# EAGLE design universal-i2c-sensor-master-unit (EAGLE 9.3.1)

## Sheet 1 of 3
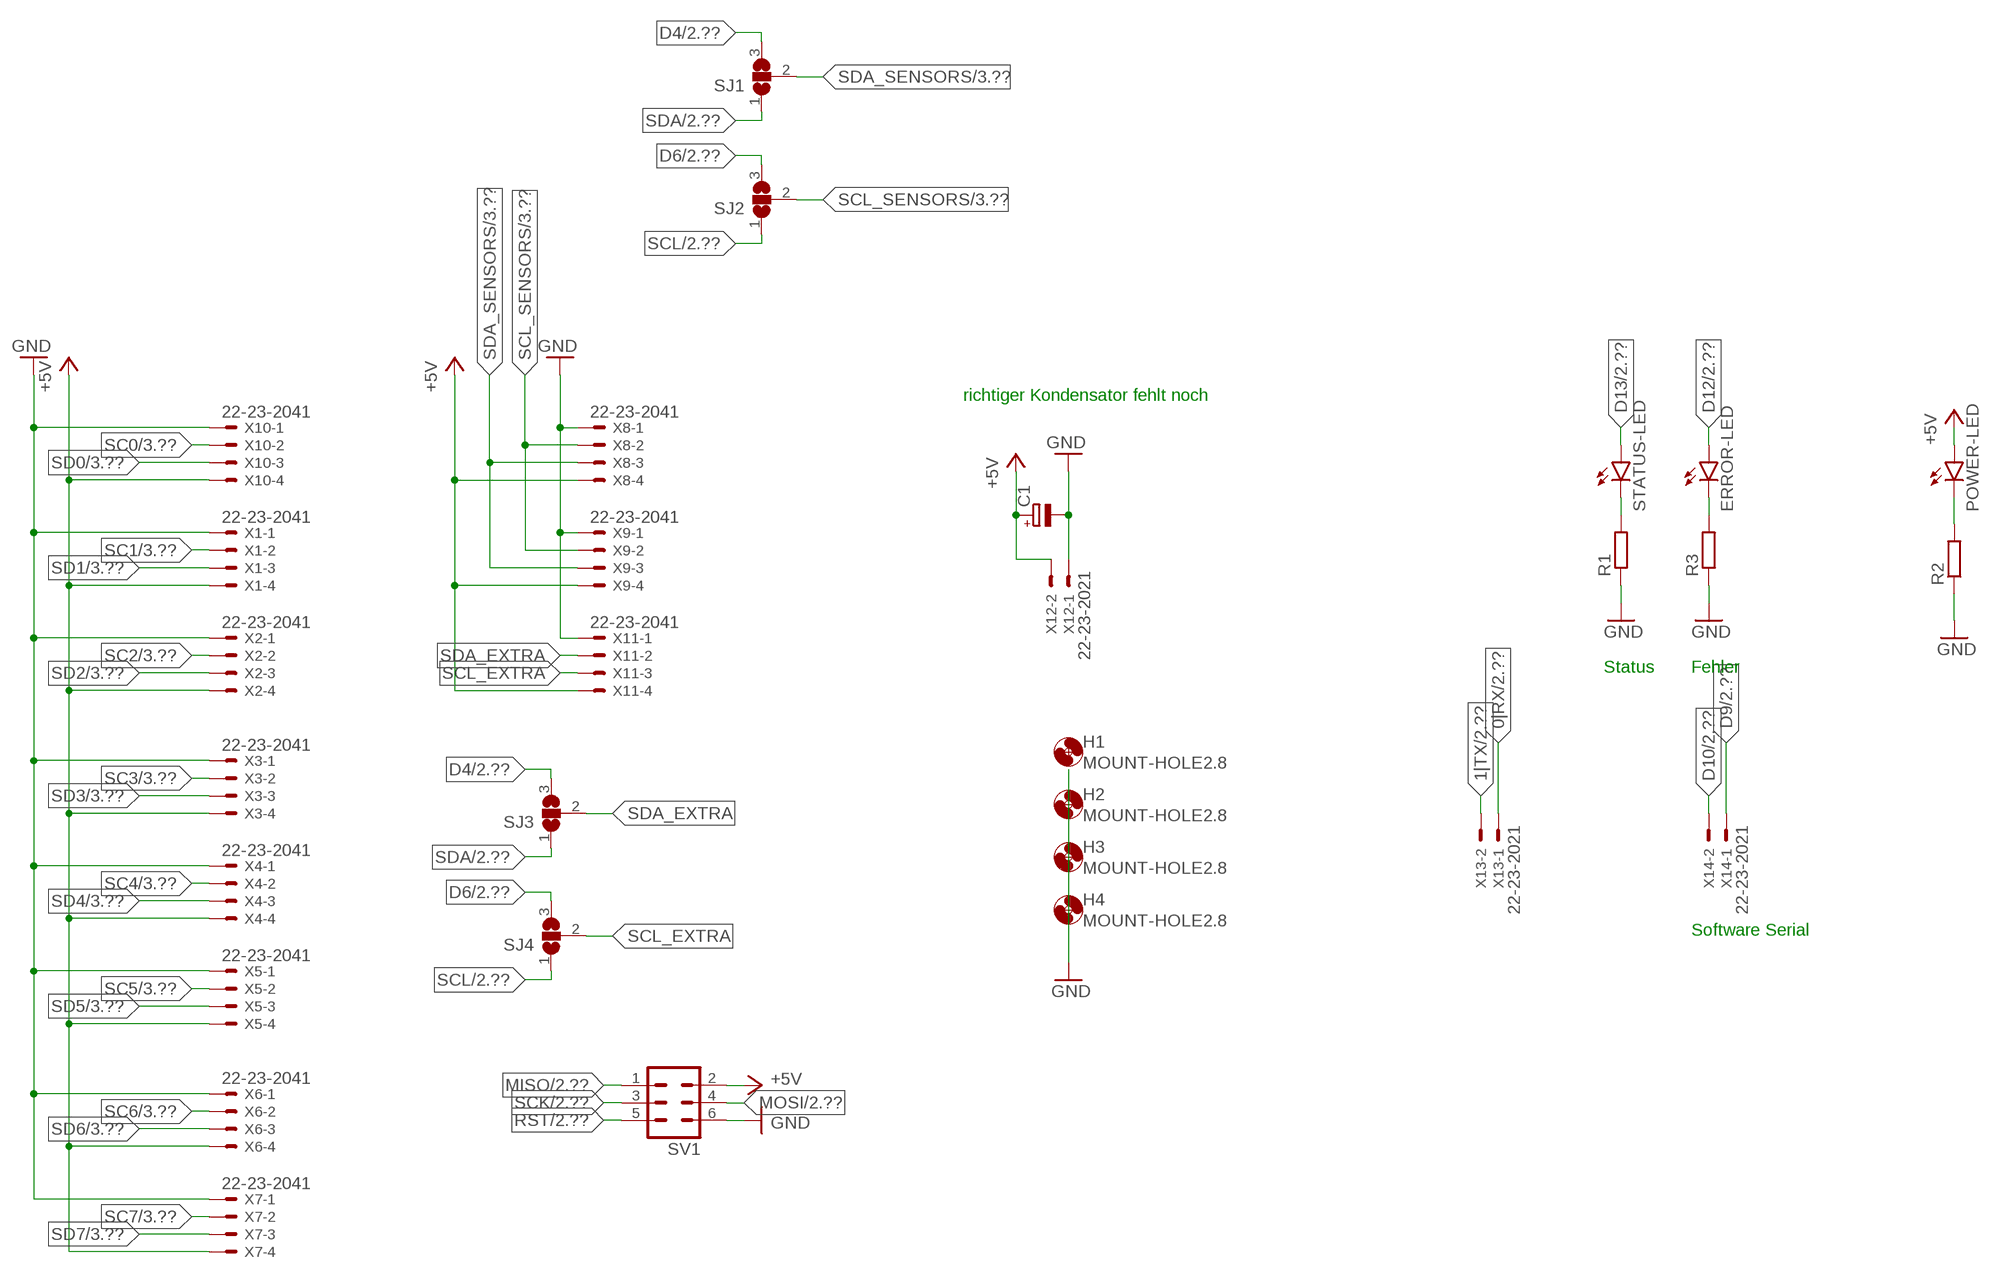
[diagram p0: schematic, sheet 1]

### Parts
C1  CPOL-EUE2.5-6  [E2,5-6]
ERROR-LED  LED3MM  [LED3MM]
H1  MOUNT-HOLE2.8  [2,8]
H2  MOUNT-HOLE2.8  [2,8]
H3  MOUNT-HOLE2.8  [2,8]
H4  MOUNT-HOLE2.8  [2,8]
POWER-LED  LED3MM  [LED3MM]
R1  R-EU_0207/10  [0207/10]
R2  R-EU_0207/10  [0207/10]
R3  R-EU_0207/10  [0207/10]
SJ1  SJ2W  [SJ_2]
SJ2  SJ2W  [SJ_2]
SJ3  SJ2W  [SJ_2]
SJ4  SJ2W  [SJ_2]
STATUS-LED  LED3MM  [LED3MM]
SV1  MA03-2  [MA03-2]
X1  22-23-2041  [22-23-2041]
X2  22-23-2041  [22-23-2041]
X3  22-23-2041  [22-23-2041]
X4  22-23-2041  [22-23-2041]
X5  22-23-2041  [22-23-2041]
X6  22-23-2041  [22-23-2041]
X7  22-23-2041  [22-23-2041]
X8  22-23-2041  [22-23-2041]
X9  22-23-2041  [22-23-2041]
X10  22-23-2041  [22-23-2041]
X11  22-23-2041  [22-23-2041]
X12  22-23-2021  [22-23-2021]
X13  22-23-2021  [22-23-2021]
X14  22-23-2021  [22-23-2021]

### Nets
0|RX: X13.1 ; also sheet 2
1|TX: X13.2 ; also sheet 2
+5V: C1.+ POWER-LED.A SV1.2 X1.4 X2.4 X3.4 X4.4 X5.4 X6.4 X7.4 X8.4 X9.4 X10.4 X11.4 X12.2 ; also sheet 2,3
D4: SJ1.3 SJ3.3 ; also sheet 2
D6: SJ2.3 SJ4.3 ; also sheet 2
D9: X14.1 ; also sheet 2
D10: X14.2 ; also sheet 2
D12: ERROR-LED.A ; also sheet 2
D13: STATUS-LED.A ; also sheet 2
GND: C1.- R1.1 R2.1 R3.1 SV1.6 X1.1 X2.1 X3.1 X4.1 X5.1 X6.1 X7.1 X8.1 X9.1 X10.1 X11.1 X12.1 ; also sheet 2,3
MISO: SV1.1 ; also sheet 2
MOSI: SV1.4 ; also sheet 2
N$1: R1.2 STATUS-LED.K(C)
N$2: POWER-LED.K(C) R2.2
N$3: ERROR-LED.K(C) R3.2
RST: SV1.5 ; also sheet 2
SC0: X10.2 ; also sheet 3
SC1: X1.2 ; also sheet 3
SC2: X2.2 ; also sheet 3
SC3: X3.2 ; also sheet 3
SC4: X4.2 ; also sheet 3
SC5: X5.2 ; also sheet 3
SC6: X6.2 ; also sheet 3
SC7: X7.2 ; also sheet 3
SCK: SV1.3 ; also sheet 2
SCL: SJ2.1 SJ4.1 ; also sheet 2
SCL_EXTRA: SJ4.2 X11.3
SCL_SENSORS: SJ2.2 X8.2 X9.2 ; also sheet 3
SD0: X10.3 ; also sheet 3
SD1: X1.3 ; also sheet 3
SD2: X2.3 ; also sheet 3
SD3: X3.3 ; also sheet 3
SD4: X4.3 ; also sheet 3
SD5: X5.3 ; also sheet 3
SD6: X6.3 ; also sheet 3
SD7: X7.3 ; also sheet 3
SDA: SJ1.1 SJ3.1 ; also sheet 2
SDA_EXTRA: SJ3.2 X11.2
SDA_SENSORS: SJ1.2 X8.3 X9.3 ; also sheet 3

### Notes on the sheet
- richtiger Kondensator fehlt noch
- Status | Fehler
- Software Serial

## Sheet 2 of 3
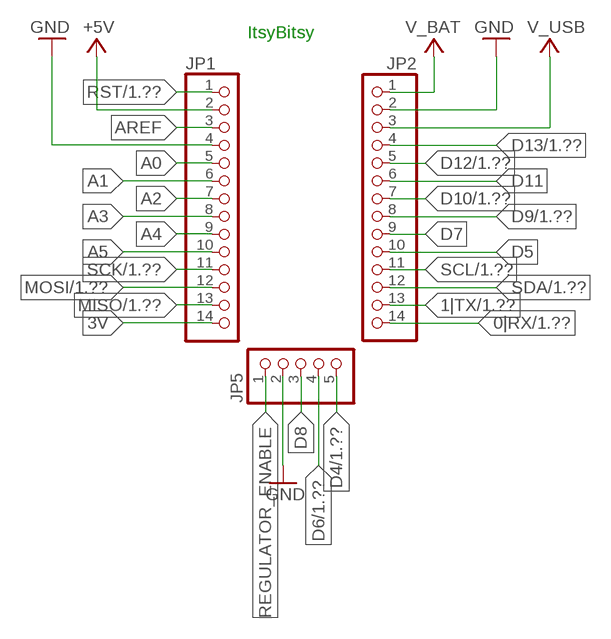
[diagram p1: schematic, sheet 2]

### Parts
JP1  PINHD-1X14  [1X14]
JP2  PINHD-1X14  [1X14]
JP5  PINHD-1X5  [1X05]

### Nets
0|RX: JP2.14 ; also sheet 1
1|TX: JP2.13 ; also sheet 1
3V: JP1.14
+5V: JP1.2 ; also sheet 1,3
A0: JP1.5
A1: JP1.6
A2: JP1.7
A3: JP1.8
A4: JP1.9
A5: JP1.10
AREF: JP1.3
D4: JP5.5 ; also sheet 1
D5: JP2.10
D6: JP5.4 ; also sheet 1
D7: JP2.9
D8: JP5.3
D9: JP2.8 ; also sheet 1
D10: JP2.7 ; also sheet 1
D11: JP2.6
D12: JP2.5 ; also sheet 1
D13: JP2.4 ; also sheet 1
GND: JP1.4 JP2.2 JP5.2 ; also sheet 1,3
MISO: JP1.13 ; also sheet 1
MOSI: JP1.12 ; also sheet 1
REGULATOR_ENABLE: JP5.1
RST: JP1.1 ; also sheet 1
SCK: JP1.11 ; also sheet 1
SCL: JP2.11 ; also sheet 1
SDA: JP2.12 ; also sheet 1
V_BAT: JP2.1
V_USB: JP2.3

### Notes on the sheet
- ItsyBitsy

## Sheet 3 of 3
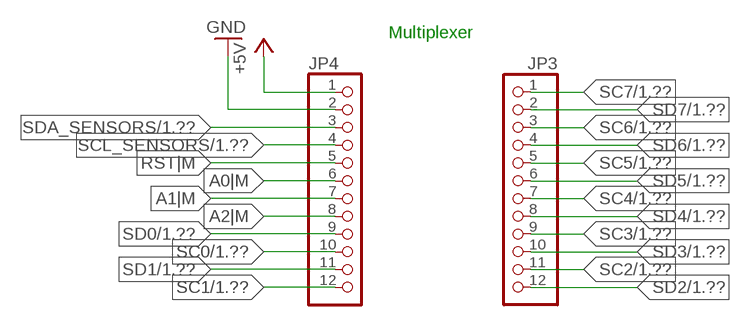
[diagram p2: schematic, sheet 3]

### Parts
JP3  PINHD-1X12  [1X12]
JP4  PINHD-1X12  [1X12]

### Nets
+5V: JP4.1 ; also sheet 1,2
A0|M: JP4.6
A1|M: JP4.7
A2|M: JP4.8
GND: JP4.2 ; also sheet 1,2
RST|M: JP4.5
SC0: JP4.10 ; also sheet 1
SC1: JP4.12 ; also sheet 1
SC2: JP3.11 ; also sheet 1
SC3: JP3.9 ; also sheet 1
SC4: JP3.7 ; also sheet 1
SC5: JP3.5 ; also sheet 1
SC6: JP3.3 ; also sheet 1
SC7: JP3.1 ; also sheet 1
SCL_SENSORS: JP4.4 ; also sheet 1
SD0: JP4.9 ; also sheet 1
SD1: JP4.11 ; also sheet 1
SD2: JP3.12 ; also sheet 1
SD3: JP3.10 ; also sheet 1
SD4: JP3.8 ; also sheet 1
SD5: JP3.6 ; also sheet 1
SD6: JP3.4 ; also sheet 1
SD7: JP3.2 ; also sheet 1
SDA_SENSORS: JP4.3 ; also sheet 1

### Notes on the sheet
- Multiplexer

## Library data of the parts
C1 = rcl:CPOL-EU: POLARIZED CAPACITOR, European symbol; SPICEPREFIX: C
ERROR-LED POWER-LED STATUS-LED = led:LED: LED OSRAM: - CHIPLED LG R971, LG N971, LY N971, LG Q971, LY Q971, LO R971, LY R971 LH N974, LH R974 LS Q976, LO Q976, LY Q976 LO Q996 - Hyper CHIPLED LW Q18S LB Q993, LB Q99A, LB R99A - SideLED LS A670, LO A670, LY A670, LG A670, LP A670 LB A673, LV A673, LT A673, LW A673 LH A674 LY A675 LS A676, LA A676, LO A676, LY A676, LW A676 LS A679, LY A679, LG A679 - Hyper Micro SIDELED® LS Y876, LA Y876, LO Y876, LY Y876 LT Y87S - SmartLED LW L88C, LW L88S LB L89C, LB L89S, LG L890 LS L89K, LO L89K, LY L89K LS L896, LA L896, LO L896, LY L896 - TOPLED LS T670, LO T670, LY T670, LG T670, LP T670 LSG T670, LSP T670, LSY T670, LOP T670, LYG T670 LG T671, LOG T671, LSG T671 LB T673, LV T673, LT T673, LW T673 LH T674 LS T676, LA T676, LO T676, LY T676, LB T676, LH T676, LSB T676, LW T676 LB T67C, LV T67C, LT T67C, LS T67K, LO T67K, LY T67K, LW E67C LS E67B, LA E67B, LO E67B, LY E67B, LB E67C, LV E67C, LT E67C LW T67C LS T679, LY T679, LG T679 LS T770, LO T770, LY T770, LG T770, LP T770 LB T773, LV T773, LT T773, LW T773 LH T774 LS E675, LA E675, LY E675, LS T675 LS T776, LA T776, LO T776, LY T776, LB T776 LHGB T686 LT T68C, LB T68C - Hyper Mini TOPLED® LB M676 - Mini TOPLED Santana® LG M470 LS M47K, LO M47K, LY M47K Source: http://www.osram.convergy.de LUXEON: - LUMILED® LXK2-PW12-R00, LXK2-PW12-S00, LXK2-PW14-U00, LXK2-PW14-V00 LXK2-PM12-R00, LXK2-PM12-S00, LXK2-PM14-U00 LXK2-PE12-Q00, LXK2-PE12-R00, LXK2-PE12-S00, LXK2-PE14-T00, LXK2-PE14-U00 LXK2-PB12-K00, LXK2-PB12-L00, LXK2-PB12-M00, LXK2-PB14-N00, LXK2-PB14-P00, LXK2-PB14-Q00 LXK2-PR12-L00, LXK2-PR12-M00, LXK2-PR14-Q00, LXK2-PR14-R00 LXK2-PD12-Q00, LXK2-PD12-R00, LXK2-PD12-S00 LXK2-PH12-R00, LXK2-PH12-S00 LXK2-PL12-P00, LXK2-PL12-Q00, LXK2-PL12-R00 Source: www.luxeon.com KINGBRIGHT: KA-3528ASYC Source: www.kingbright.com
H1-H4 = holes:MOUNT-HOLE: MOUNTING HOLE with drill center marker
JP1 JP2 = pinhead:PINHD-1X14: PIN HEADER
JP3 JP4 = pinhead:PINHD-1X12: PIN HEADER
JP5 = pinhead:PINHD-1X5: PIN HEADER
R1-R3 = rcl:R-EU_: RESISTOR, European symbol; SPICEPREFIX: R
SJ1-SJ4 = jumper:SJ2W: SMD solder JUMPER
SV1 = con-lstb:MA03-2: PIN HEADER; OC_FARNELL: unknown; OC_NEWARK: unknown
X1-X11 = con-molex:22-23-2041: .100" (2.54mm) Center Header - 4 Pin; MF: MOLEX; MPN: 22-23-2041; OC_FARNELL: 1462920; OC_NEWARK: 38C0355
X12-X14 = con-molex:22-23-2021: .100" (2.54mm) Center Header - 2 Pin; MF: MOLEX; MPN: 22-23-2021; OC_FARNELL: 1462926; OC_NEWARK: 25C3832

## Board
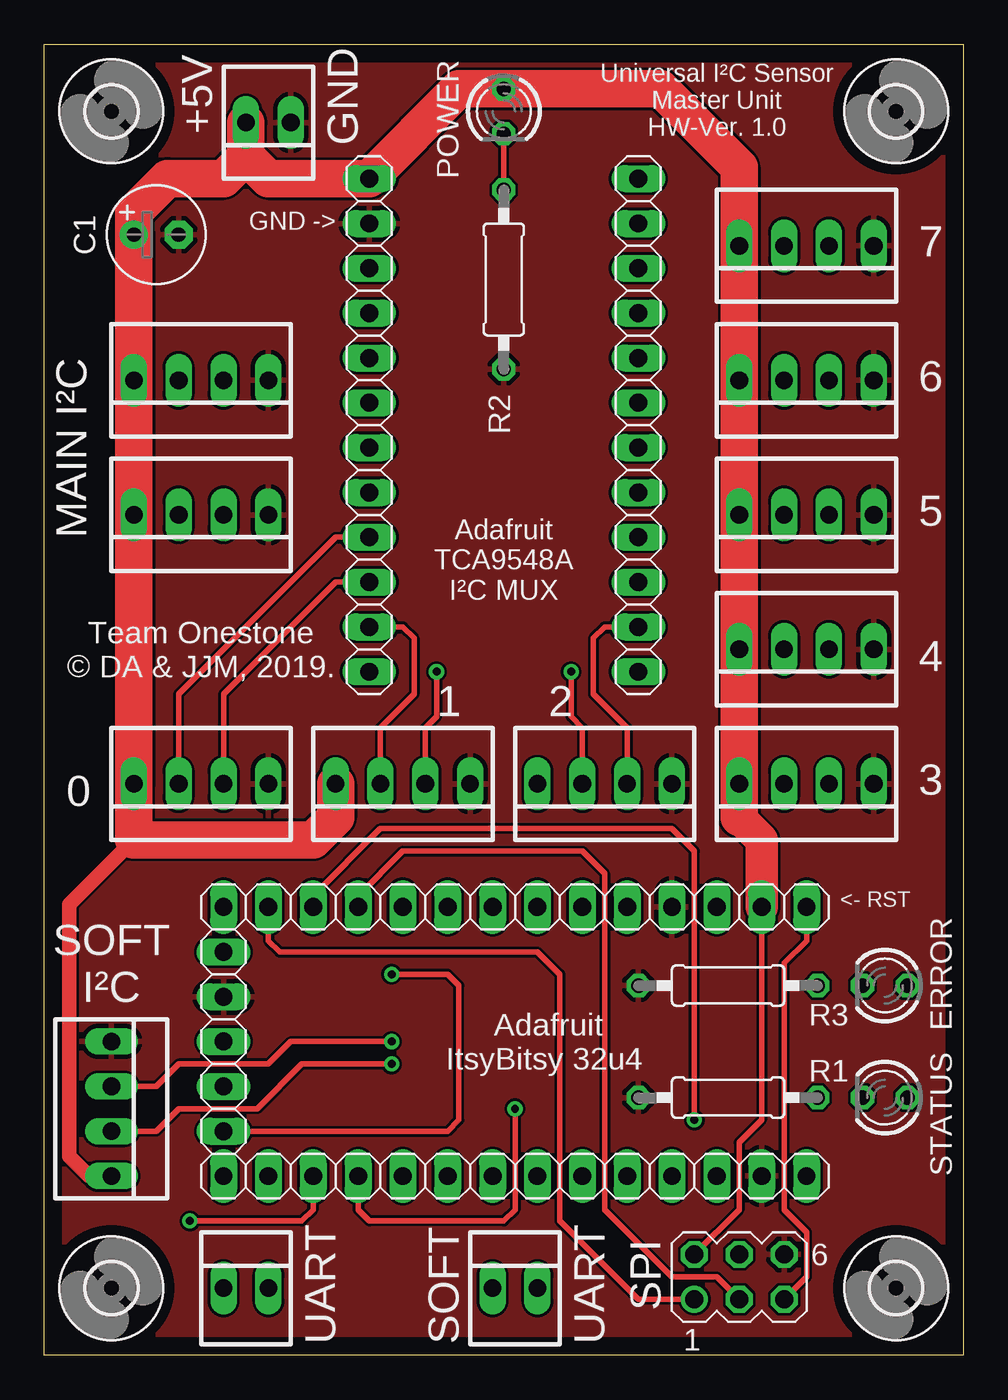
[diagram p3: board, top side]
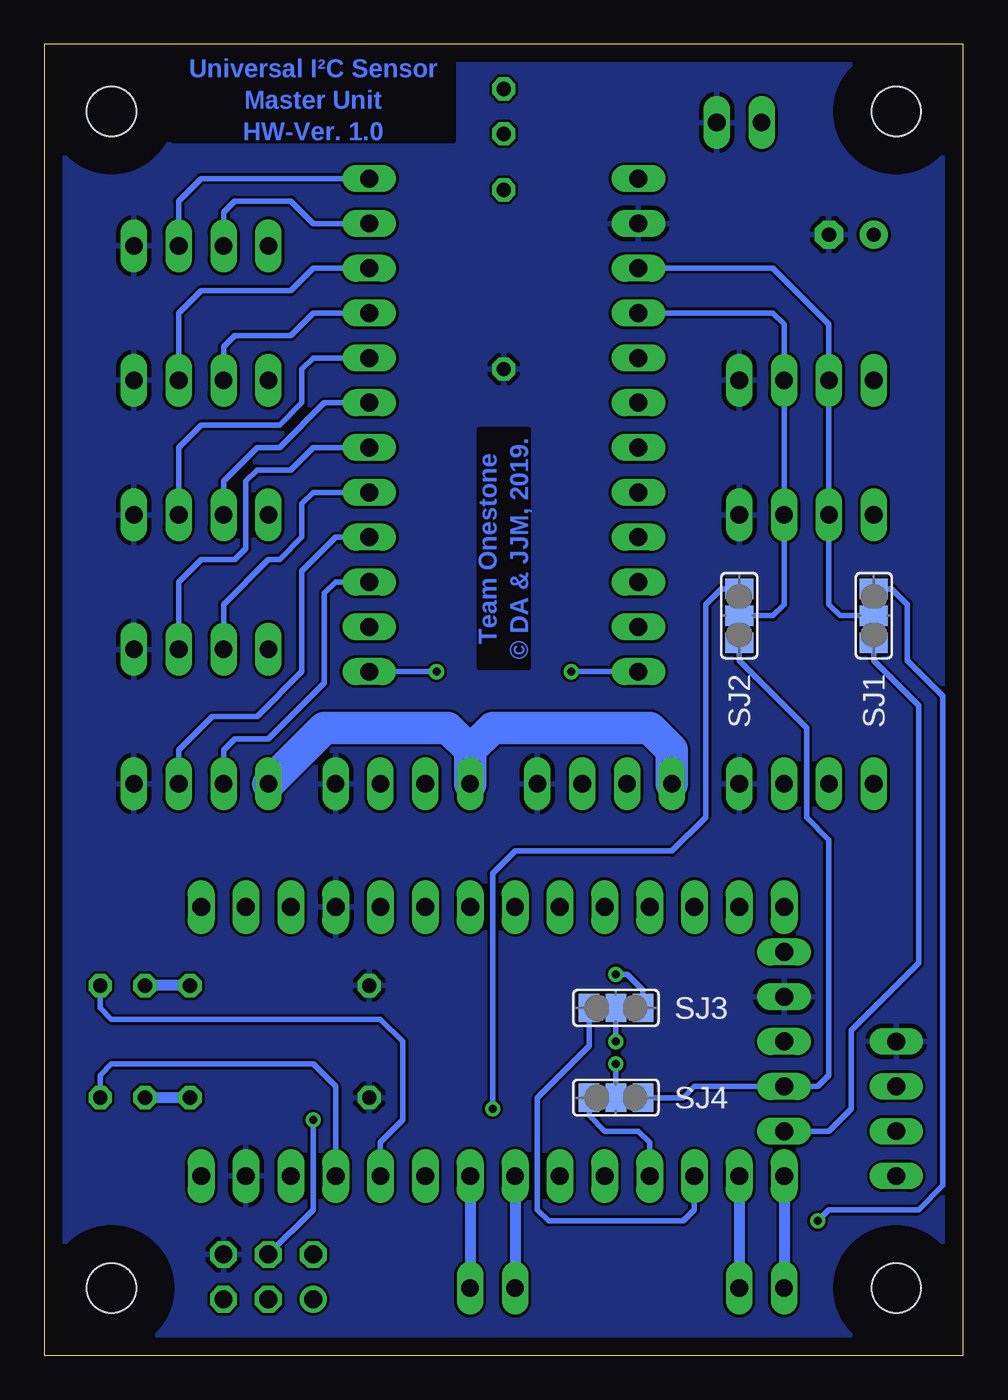
[diagram p4: board, bottom side, seen from below]

Size 52.07 x 74.3 mm. Coordinates in mm from the lower left corner, seen from the top.
Outline: 0,0 0,74.3 52.07,74.3 52.07,0 0,0
Copper layers (1*16): Top 0.035mm / dielectric 1.5mm / Bottom 0.035mm
Design rules "default": minimum track width 6mil, minimum drill 0.35mm, track to track 6mil, track to pad 6mil, pad to pad 6mil, via to via 6mil, smd to smd 6mil, copper to edge 40mil, drill to drill 6mil, minimum pad ring 10mil, minimum via ring 8mil, stop-mask expansion 4mil, vias tented up to drill 0mil, thermal gap 10mil

### Footprints (pad centres in the part's own frame; a part is rotated, then mirrored left to right if it is on the bottom)
E2,5-6 = drill 0.813 pad 1.6: + -1.27,0 | drill 0.813 pad 1.6 octagon: - 1.27,0
LED3MM = drill 0.813 octagon: A -1.27,0; K 1.27,0
2,8 = hole 2.8: 0,0
1X14 = drill 1.016 long: 1 -16.51,0; 2 -13.97,0; 3 -11.43,0; 4 -8.89,0; 5 -6.35,0; 6 -3.81,0; 7 -1.27,0; 8 1.27,0; 9 3.81,0; 10 6.35,0; 11 8.89,0; 12 11.43,0; 13 13.97,0; 14 16.51,0
1X12 = drill 1.016 long: 1 -13.97,0; 2 -11.43,0; 3 -8.89,0; 4 -6.35,0; 5 -3.81,0; 6 -1.27,0; 7 1.27,0; 8 3.81,0; 9 6.35,0; 10 8.89,0; 11 11.43,0; 12 13.97,0
1X05 = drill 1.016 long: 1 -5.08,0; 2 -2.54,0; 3 0,0; 4 2.54,0; 5 5.08,0
0207/10 = drill 0.813 octagon: 1 -5.08,0; 2 5.08,0
SJ_2 = smd 1.168 x 1.6: 1 -1.524,0; 2 0,0; 3 1.524,0
MA03-2 = drill 1.016: 1 -2.54,-1.27 | drill 1.016 octagon: 2 -2.54,1.27; 3 0,-1.27; 4 0,1.27; 5 2.54,-1.27; 6 2.54,1.27
22-23-2041 = drill 1 long: 1 -3.81,0; 2 -1.27,0; 3 1.27,0; 4 3.81,0
22-23-2021 = drill 1 long: 1 -1.27,0; 2 1.27,0

### Placement (x,y rotation side)
C1  6.35,63.5 0 top
ERROR-LED  47.62,20.95 180 top
H1  48.26,3.81 0 top
H2  3.81,70.48 0 top
H3  48.26,70.48 0 top
H4  3.81,3.81 0 top
JP1  26.67,25.4 180 top
JP2  26.67,10.16 180 top
JP3  33.66,52.7 270 top
JP4  18.41,52.7 270 top
JP5  10.16,17.78 270 top
POWER-LED  26.04,70.48 270 top
R1  38.73,14.61 0 top
R2  26.04,60.96 90 top
R3  38.73,20.95 0 top
SJ1  5.08,41.91 270 bottom
SJ2  12.7,41.91 270 bottom
SJ3  19.68,19.68 0 bottom
SJ4  19.68,14.61 0 bottom
STATUS-LED  47.62,14.61 180 top
SV1  39.37,4.45 0 top
X1  20.32,32.38 180 top
X2  31.75,32.38 180 top
X3  43.18,32.38 180 top
X4  43.18,40.01 180 top
X5  43.18,47.62 180 top
X6  43.18,55.24 180 top
X7  43.18,62.87 180 top
X8  8.89,47.62 180 top
X9  8.89,55.24 180 top
X10  8.89,32.38 180 top
X11  3.81,13.97 270 top
X12  12.7,69.85 180 top
X13  11.43,3.81 0 top
X14  26.67,3.81 0 top

### Tracks (layer width: path | path; a pad name or v marks a point on that pad's centre or on a via)
0|RX
  Bottom 0.61: JP2.14 X13.1
1|TX
  Bottom 0.61: JP2.13 X13.2
+5V
  Top 0.305: SV1.2 39.37,8.26 39.37,12.06 40.64,13.34 JP1.2
  Top 0.813: X11.4 2.54,10.16 1.42,11.28 1.42,25.55 5.08,29.21
  Top 1.829: 39.37,30.48 40.64,29.21 JP1.2
  Top 2.134: 11.43,67.94 X12.2 | 11.43,67.94 10.16,66.67 6.99,66.67 5.08,64.77 C1.+ X9.4 X8.4 X10.4 5.08,29.21 15.24,29.21 16.51,30.48 X1.4 | 11.43,67.94 12.7,66.67 JP4.1 23.5,71.75 POWER-LED.A 34.92,71.75 39.37,67.31 X7.4 X6.4 X5.4 X4.4 X3.4 39.37,30.48
  Bottom 1.829: X1.4 16.51,34.29 17.78,35.56 26.67,35.56 27.94,34.29 | X2.4 27.94,34.29 | 27.94,34.29 29.21,35.56 36.2,35.56 X3.4
D4  (via drill 0.45)
  Top 0.305: JP5.5 22.86,12.7 23.5,13.34 23.5,20.95 22.86,21.59 v19.68,21.59
  Bottom 0.305: v19.68,21.59 19.05,21.59 18.16,20.7 SJ3.3 | SJ1.3 5.08,39.37 2.54,36.83 2.54,22.23 6.35,18.41 6.35,13.97 7.62,12.7 JP5.5
D6
  Bottom 0.305: SJ4.3 15.88,14.61 15.24,15.24 JP5.4 8.26,15.24 7.62,15.88 7.62,29.21 8.89,30.48 8.89,35.56 12.7,39.37 SJ2.3
D9
  Bottom 0.61: JP2.8 X14.1
D10
  Bottom 0.61: JP2.7 X14.2
D12
  Bottom 0.305: JP2.5 33.02,12.06 31.75,13.34 31.75,17.78 33.02,19.05 48.26,19.05 48.9,19.68 ERROR-LED.A
D13
  Bottom 0.305: STATUS-LED.A 48.9,15.88 48.26,16.51 36.83,16.51 35.56,15.24 JP2.4
GND
  pour Bottom: 0,0 52.07,0 52.07,74.3 0,74.3
  pour Top: 0,0 52.07,0 52.07,74.3 0,74.3
MISO
  Top 0.305: SV1.1 33.66,3.17 29.21,7.62 29.21,21.59 27.94,22.86 13.34,22.86 12.7,23.5 JP1.13
MOSI  (via drill 0.45)
  Top 0.305: JP1.12 15.24,26.04 19.05,29.84 35.56,29.84 36.83,28.57 v36.83,13.34
  Bottom 0.305: v36.83,13.34 36.83,8.26 SV1.4
N$1
  Bottom 0.61: R1.2 STATUS-LED.K
N$2
  Top 0.305: R2.2 POWER-LED.K
N$3
  Bottom 0.61: R3.2 ERROR-LED.K
RST
  Top 0.305: SV1.5 43.18,4.45 43.18,6.99 41.91,8.26 41.91,22.23 43.18,23.5 JP1.1
SC0
  Top 0.305: X10.2 10.16,37.47 16.51,43.81 JP4.10
SC1  (via drill 0.45)
  Top 0.305: X1.2 21.59,35.56 22.23,36.2 v22.23,38.73
  Bottom 0.305: JP4.12 v22.23,38.73
SC2
  Top 0.305: JP3.11 31.75,41.27 31.11,40.64 31.11,37.47 33.02,35.56 X2.2
SC3
  Bottom 0.305: X3.2 44.45,34.29 42.55,36.2 40.01,36.2 37.47,38.73 37.47,44.45 35.56,46.35 JP3.9
SC4
  Bottom 0.305: X4.2 44.45,43.81 43.18,45.09 41.27,45.09 40.64,45.72 40.64,49.53 40.01,50.16 38.1,50.16 36.83,51.44 JP3.7
SC5
  Bottom 0.305: JP3.5 36.83,56.52 37.47,55.88 37.47,53.98 38.73,52.7 43.18,52.7 44.45,51.44 X5.2
SC6
  Bottom 0.305: JP3.3 36.83,61.59 38.1,60.33 43.18,60.33 44.45,59.05 X6.2
SC7
  Bottom 0.305: JP3.1 43.18,66.67 44.45,65.41 X7.2
SCK
  Top 0.305: SV1.3 38.1,4.45 35.56,4.45 31.75,8.26 31.75,27.3 30.48,28.57 20.32,28.57 17.78,26.04 JP1.11
SCL  (via drill 0.45)
  Top 0.305: v26.67,13.97 26.67,8.26 26.04,7.62 18.41,7.62 17.78,8.26 JP2.11
  Bottom 0.305: JP2.11 17.78,12.06 18.41,12.7 20.32,12.7 21.21,13.59 SJ4.1 | SJ2.1 13.72,43.43 14.61,42.55 14.61,30.48 16.51,28.57 25.4,28.57 26.67,27.3 v26.67,13.97
SCL_EXTRA  (via drill 0.45)
  Top 0.305: X11.3 6.35,12.7 7.62,13.97 12.06,13.97 14.61,16.51 v19.68,16.51
  Bottom 0.305: SJ4.2 v19.68,16.51
SCL_SENSORS
  Bottom 0.305: SJ2.2 10.79,41.91 10.16,42.55 X8.2 X9.2 10.16,58.42 10.79,59.05 JP4.4
SD0
  Top 0.305: X10.3 7.62,37.47 16.51,46.35 JP4.9
SD1
  Top 0.305: JP4.11 20.32,41.27 20.95,40.64 20.95,37.47 19.05,35.56 X1.3
SD2  (via drill 0.45)
  Top 0.305: v29.84,38.73 29.84,36.2 30.48,35.56 X2.3
  Bottom 0.305: JP3.12 v29.84,38.73
SD3
  Bottom 0.305: JP3.10 35.56,43.81 36.2,43.18 36.2,38.1 39.37,34.92 41.27,34.92 41.91,34.29 X3.3
SD4
  Bottom 0.305: JP3.8 36.83,48.9 37.47,48.26 37.47,46.35 38.73,45.09 39.37,45.09 41.91,42.55 X4.3
SD5
  Bottom 0.305: X5.3 41.91,49.53 40.01,51.44 38.73,51.44 36.2,53.98 JP3.6
SD6
  Bottom 0.305: X6.3 41.91,57.15 41.27,57.78 38.1,57.78 36.83,59.05 JP3.4
SD7
  Bottom 0.305: X7.3 41.91,64.77 41.27,65.41 38.1,65.41 36.83,64.14 JP3.2
SDA  (via drill 0.45)
  Top 0.305: JP2.12 15.24,8.26 14.61,7.62 v8.26,7.62
  Bottom 0.305: JP2.12 15.24,8.26 15.88,7.62 23.5,7.62 24.13,8.26 24.13,14.61 21.21,17.53 SJ3.1 | SJ1.1 4.06,43.43 3.17,42.55 3.17,39.37 1.17,37.36 1.17,9.63 2.54,8.26 7.62,8.26 v8.26,7.62
SDA_EXTRA  (via drill 0.45)
  Top 0.305: X11.2 6.35,15.24 7.62,16.51 12.7,16.51 13.97,17.78 v19.68,17.78
  Bottom 0.305: SJ3.2 v19.68,17.78
SDA_SENSORS
  Bottom 0.305: SJ1.2 6.99,41.91 7.62,42.55 X8.3 X9.3 7.62,58.42 10.79,61.59 JP4.3

### Text on the board
Bottom: Universal I²C Sensor / Master Unit / HW-Ver. 1.0 | Team Onestone / © DA & JJM, 2019.
tPlace: Universal I²C Sensor / Master Unit / HW-Ver. 1.0 | +5V | GND | POWER | GND -> | 7 | MAIN I²C | 6 | 5 | Adafruit / TCA9548A / I²C MUX | Team Onestone / © DA & JJM, 2019. | 4 | 1 | 2 | 3 | 0 | <- RST | SOFT / I²C | Adafruit / ItsyBitsy 32u4 | ERROR | STATUS | SPI | UART | SOFT | UART